# EAGLE design SHT31 (EAGLE 6.4)
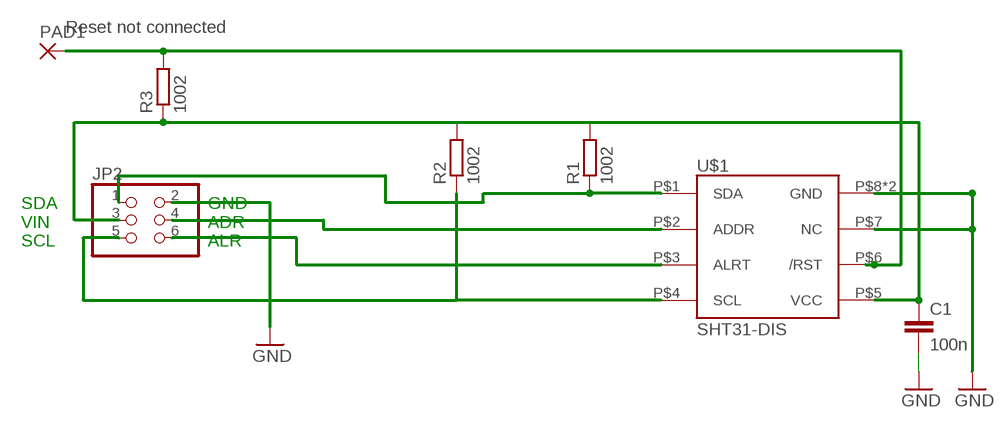
[diagram p0: schematic, sheet 1]

## Parts
C1  100n  C-EUC0805K  [C0805K]
JP2  PINHD-2X3  [2X03]
PAD1  1,6/0,8  [1,6/0,8]
R1  1002  R-EU_R0805  [R0805]
R2  1002  R-EU_R0805  [R0805]
R3  1002  R-EU_R0805  [R0805]
U$1  SHT31-DIS  [SHT3X]

## Nets
GND: C1.2 JP2.2 U$1.P$7(NC) U$1.P$8(GND) U$1.PAD(GND)
N$2: JP2.5 R2.1 U$1.P$4(SCL)
N$3: JP2.1 R1.1 U$1.P$1(SDA)
N$4: JP2.4 U$1.P$2(ADDR)
N$5: JP2.6 U$1.P$3(ALRT)
N$6: PAD1.1(P) R3.2 U$1.P$6(/RST)
N$7: C1.1 JP2.3 R1.2 R2.2 R3.1 U$1.P$5(VCC)

## Notes on the sheet
- Reset not connected
- SDA
  VIN
  SCL
- GND
  ADR
  ALR

## Library data of the parts
C1 = rcl:C-EU: CAPACITOR, European symbol
JP2 = pinhead:PINHD-2X3: PIN HEADER
PAD1 = wirepad:1,6/0,8: THROUGH-HOLE PAD
R1-R3 = rcl:R-EU_: RESISTOR, European symbol
U$1 = sht31_sensirion:SHT31-DIS

## Board
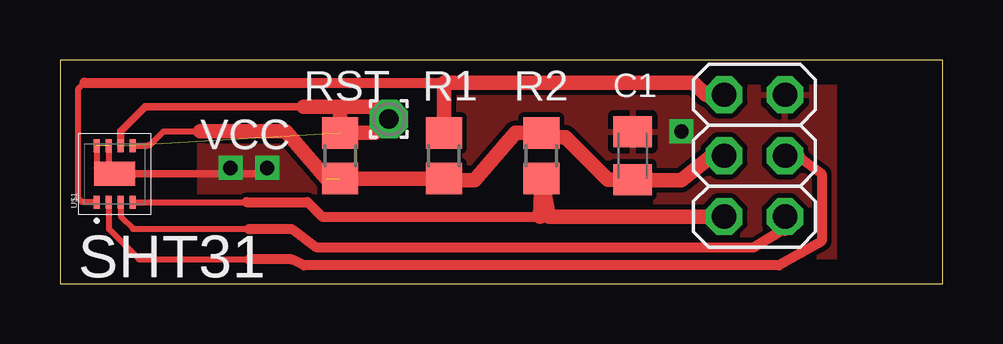
[diagram p1: board, top side]
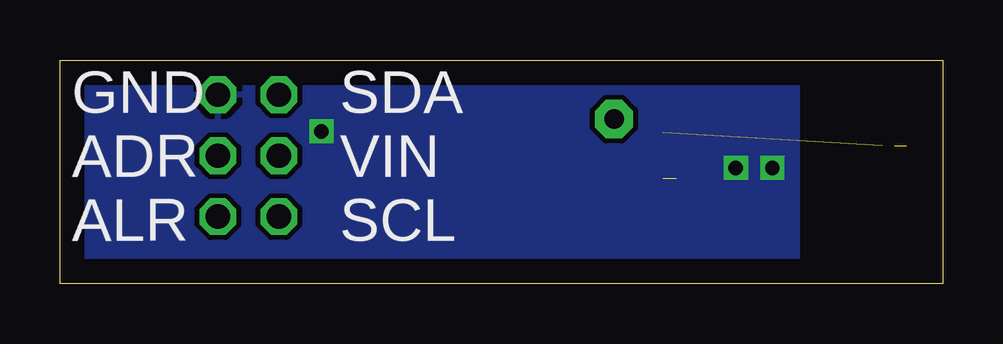
[diagram p2: board, bottom side, seen from below]

Size 36.81 x 9.32 mm. Coordinates in mm from the lower left corner, seen from the top.
Outline: 0,0 36.81,0 36.81,9.32 0,9.32 0,0
Copper layers (1*16): Top 0.035mm / dielectric 1.5mm / Bottom 0.035mm
Design rules "default": minimum track width 10mil, minimum drill 24mil, track to track 8mil, track to pad 8mil, pad to pad 8mil, via to via 8mil, smd to smd 8mil, copper to edge 40mil, drill to drill 8mil, minimum pad ring 10mil, minimum via ring 8mil, stop-mask expansion 4mil, vias tented up to drill 0mil, thermal gap 10mil
tRestrict: area 2.3,6.6 to 3,7.6

### Footprints (pad centres in the part's own frame; a part is rotated, then mirrored left to right if it is on the bottom)
C0805K = smd 1.3 x 1.6: 1 -1,0; 2 1,0
2X03 = drill 1.016 octagon: 1 -2.54,-1.27; 2 -2.54,1.27; 3 0,-1.27; 4 0,1.27; 5 2.54,-1.27; 6 2.54,1.27
1,6/0,8 = drill 0.813 pad 1.6 octagon: 1 0,0
R0805 = smd 1.3 x 1.5: 1 -0.95,0; 2 0.95,0
SHT3X = smd 0.55 x 0.25: P$1 -1.175,0.75; P$2 -1.175,0.25; P$3 -1.175,-0.25; P$4 -1.175,-0.75; P$5 1.175,-0.75; P$6 1.175,-0.25; P$7 1.175,0.25; P$8 1.175,0.75 | smd 1 x 1.7: PAD 0,0

### Placement (x,y rotation side)
C1  23.88,5.33 90 top
JP2  28.96,5.33 270 top
PAD1  13.72,6.86 0 top
R1  16,5.33 270 top
R2  20.07,5.33 90 top
R3  11.68,5.33 90 top
U$1  2.29,4.57 90 top

### Tracks (layer width: path | path; a pad name or v marks a point on that pad's centre or on a via)
GND  (via drill 0.6)  (1 unrouted)
  Top 0.254: U$1.P$7 2.04,4.82 U$1.PAD | U$1.P$8 1.54,4.84 1.52,4.83
  Top 0.305: U$1.PAD 8.64,4.57 v8.64,4.83
  other vias: 25.91,6.35 7.11,4.83
  pour Top: 5.84,8.89 32.26,8.89 32.26,-0.25 5.84,-0.25
  pour Bottom: 36.83,9.4 6.1,9.4 6.1,0 36.83,0
N$1
  Top 0.305: 2.54,6.35 3.56,7.37 10.16,7.37
  Top 0.61: 13.72,6.86 13.21,7.37 10.16,7.37
N$2
  Top 0.254: U$1.P$4 7.78,3.4
  Top 0.406: 7.78,3.4 10.32,3.4 10.92,2.79 20,2.79
  Top 0.61: JP2.5 20.39,2.79 R2.1 20,2.79
N$3
  Top 0.254: U$1.P$1 0.92,3.4 0.76,3.56 0.76,8.13 1.02,8.38
  Top 0.406: 1.02,8.38 16,8.38
  Top 0.61: JP2.1 26.92,7.87 26.42,8.38 16,8.38 R1.1
N$4
  Top 0.254: U$1.P$2 2.04,2.28 3.3,1.02 7.87,1.02
  Top 0.406: 30.73,5.33 31.75,4.57 31.75,1.78 29.97,0.76 10.16,0.76 9.65,1.02 7.87,1.02
  Top 0.61: JP2.4 30.73,5.33
N$5
  Top 0.254: U$1.P$3 2.54,2.8 3.05,2.29 7.87,2.29
  Top 0.406: 30.23,2.29 28.96,1.52 10.67,1.52 9.65,2.29 7.87,2.29
  Top 0.61: JP2.6 30.23,2.29
N$6  (1 unrouted)
  Top 0.305: U$1.P$6 2.54,6.35
  Top 0.61: PAD1.1 13.14,6.28 R3.2 11.68,7.37
N$7  (1 unrouted)
  Top 0.254: U$1.P$5 3.64,5.76 arc45 3.79,5.82 4.32,6.35 5.84,6.35
  Top 0.61: JP2.3 27.18,5.33 25.91,4.32 23.89,4.32 C1.1 22.84,4.33 21.08,6.1 20.25,6.1 R2.2 18.98,6.28 17.27,4.32 16.19,4.32 R1.2 11.11,4.38 9.4,6.35 5.84,6.35

### Text on the board
tNames: RST | VCC | SHT31
bNames: SDA / VIN / SCL | GND / ADR / ALR